# EAGLE schematic Spring12_6_Node (EAGLE 6.1)
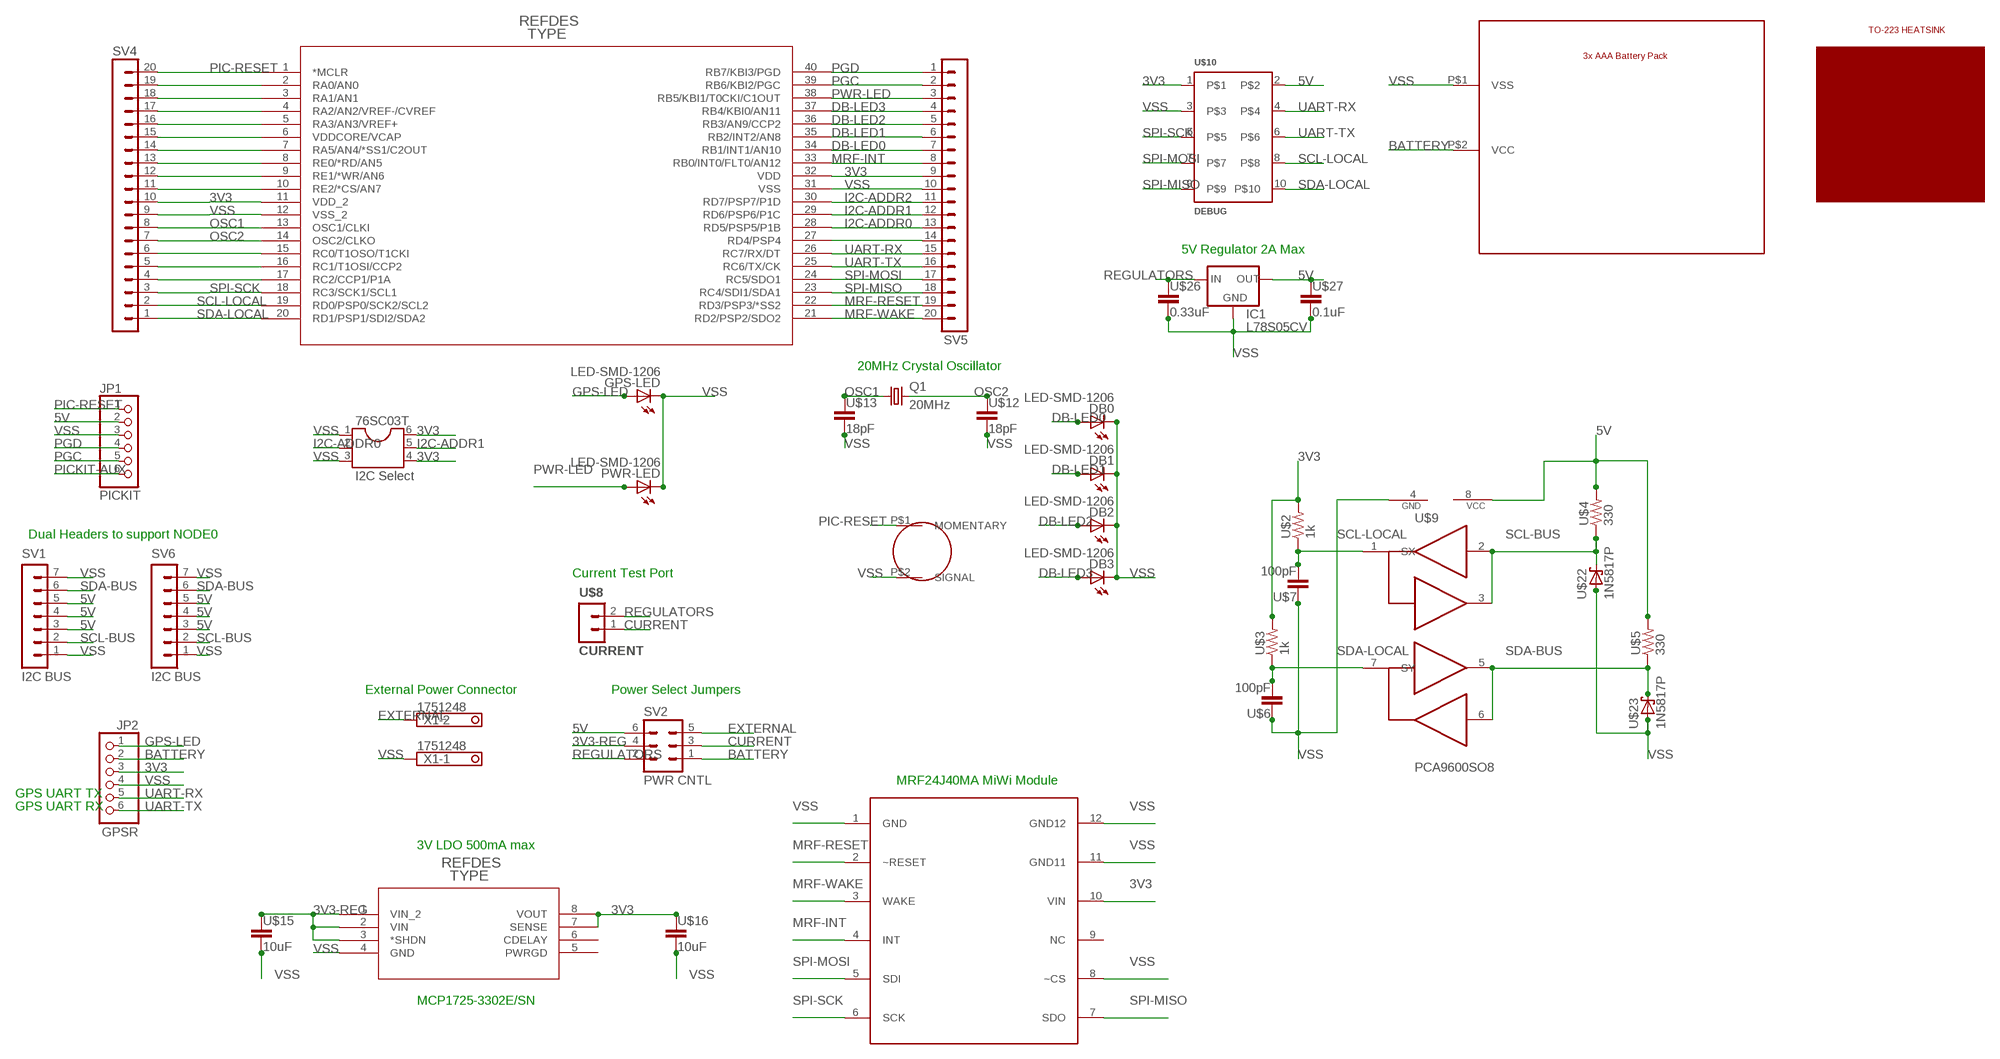
[diagram p0: schematic, sheet 1]

## Parts
76SC03T  I2C Select  DIL6  [DIL06]
DB0  LED-SMD-1206  [LED1206]
DB1  LED-SMD-1206  [LED1206]
DB2  LED-SMD-1206  [LED1206]
DB3  LED-SMD-1206  [LED1206]
GPS-LED  LED-SMD-1206  [LED1206]
IC1  L78S05CV  78XXL  [78XXL]
JP1  PICKIT  PINHD-1X6/90  [1X06/90]
JP2  GPSR  PINHD-1X6/90  [1X06/90]
PWR-LED  LED-SMD-1206  [LED1206]
Q1  20MHz  CRYSTALHC49U-V  [HC49U-V]
SV1  I2C BUS  MA07-1  [MA07-1]
SV2  PWR CNTL  MA03-2  [MA03-2]
SV4  MA20-1  [MA20-1]
SV5  MA20-1  [MA20-1]
SV6  I2C BUS  MA07-1  [MA07-1]
U$1  PIC18F45J10-X/P  [PDIP40_600MC]
U$2  1k  R-1/4W  [R-1/4W]
U$3  1k  R-1/4W  [R-1/4W]
U$4  330  R-1/4W  [R-1/4W]
U$5  330  R-1/4W  [R-1/4W]
U$6  100pF  C2.5-5  [C2.5-5]
U$7  100pF  C2.5-5  [C2.5-5]
U$8  CURRENT  MA02-1  [MA02-1]
U$9  PCA9600SO8  [SO08]
U$10  DEBUG  2510-6002  [2510-6002]
U$11  MRF24J40MA  [PCB12]
U$12  18pF  C2.5-5  [C2.5-5]
U$13  18pF  C2.5-5  [C2.5-5]
U$14  MCP1725-XXXXX/SN  [SOIC8-N_MC]
U$15  10uF  C2.5-5  [C2.5-5]
U$16  10uF  C2.5-5  [C2.5-5]
U$17  2479-BATTERY  [2479-BATTERY]
U$22  1N5817P  [1N5817]
U$23  1N5817P  [1N5817]
U$25  EVQ-11U05R  [EVQ-11U05R]
U$26  0.33uF  C2.5-5  [C2.5-5]
U$27  0.1uF  C2.5-5  [C2.5-5]
U$28  7-361-BA  [7-361-BA]
X1  1751248  [1751248]

## Nets
3V3: 76SC03T.4 76SC03T.6 JP2.3 SV4.10 SV5.9 U$1.11(VDD_2) U$1.32(VDD) U$2.2 U$3.2 U$10.1 U$11.10(VIN) U$14.7(SENSE) U$14.8(VOUT) U$16.1
3V3-REG: SV2.4 U$14.1(VIN_2) U$14.2(VIN) U$14.3(*SHDN) U$15.1
5V: IC1.OUT JP1.2 SV1.3 SV1.4 SV1.5 SV2.6 SV6.3 SV6.4 SV6.5 U$4.2 U$5.2 U$9.8(VCC) U$10.2 U$27.1
BATTERY: JP2.2 SV2.1 U$17.P$2(VCC)
CURRENT: SV2.3 U$8.1
DB-LED0: DB0.A SV5.7 U$1.34(RB1/INT1/AN10)
DB-LED1: DB1.A SV5.6 U$1.35(RB2/INT2/AN8)
DB-LED2: DB2.A SV5.5 U$1.36(RB3/AN9/CCP2)
DB-LED3: DB3.A SV5.4 U$1.37(RB4/KBI0/AN11)
EXTERNAL: SV2.5 X1.2
GPS-LED: GPS-LED.A JP2.1
I2C-ADDR0: 76SC03T.2 SV5.13 U$1.28(RD5/PSP5/P1B)
I2C-ADDR1: 76SC03T.5 SV5.12 U$1.29(RD6/PSP6/P1C)
I2C-ADDR2: SV5.11 U$1.30(RD7/PSP7/P1D)
MRF-INT: SV5.8 U$1.33(RB0/INT0/FLT0/AN12) U$11.4(INT)
MRF-RESET: SV5.19 U$1.22(RD3/PSP3/*SS2) U$11.2(~RESET)
MRF-WAKE: SV5.20 U$1.21(RD2/PSP2/SDO2) U$11.3(WAKE)
N$1: SV4.13 U$1.8(RE0/*RD/AN5)
N$2: SV4.6 U$1.15(RC0/T1OSO/T1CKI)
N$3: SV4.5 U$1.16(RC1/T1OSI/CCP2)
N$8: SV5.14 U$1.27(RD4/PSP4)
N$13: SV4.19 U$1.2(RA0/AN0)
N$14: SV4.18 U$1.3(RA1/AN1)
N$15: SV4.17 U$1.4(RA2/AN2/VREF-/CVREF)
N$16: SV4.16 U$1.5(RA3/AN3/VREF+)
N$17: SV4.15 U$1.6(VDDCORE/VCAP)
N$18: SV4.14 U$1.7(RA5/AN4/*SS1/C2OUT)
N$20: SV4.12 U$1.9(RE1/*WR/AN6)
N$21: SV4.11 U$1.10(RE2/*CS/AN7)
N$26: SV4.4
OSC1: Q1.1 SV4.8 U$1.13(OSC1/CLKI) U$13.1
OSC2: Q1.2 SV4.7 U$1.14(OSC2/CLKO) U$12.1
PGC: JP1.5 SV5.2 U$1.39(RB6/KBI2/PGC)
PGD: JP1.4 SV5.1 U$1.40(RB7/KBI3/PGD)
PIC-RESET: JP1.1 SV4.20 U$1.1(*MCLR) U$25.P$1(MOMENTARY)
PICKIT-AUX: JP1.6
PWR-LED: PWR-LED.A SV5.3 U$1.38(RB5/KBI1/T0CKI/C1OUT)
REGULATORS: IC1.IN SV2.2 U$8.2 U$26.1
SCL-BUS: SV1.2 SV6.2 U$4.1 U$9.2(RX) U$9.3(TX) U$22.C
SCL-LOCAL: SV4.2 U$2.1 U$7.2 U$9.1(SX) U$10.8
SDA-BUS: SV1.6 SV6.6 U$5.1 U$9.5(TY) U$9.6(RY) U$23.C
SDA-LOCAL: SV4.1 U$1.20(RD1/PSP1/SDI2/SDA2) U$3.1 U$6.2 U$9.7(SY) U$10.10
SPI-MISO: SV5.18 U$1.23(RC4/SDI1/SDA1) U$10.9 U$11.7(SDO)
SPI-MOSI: SV5.17 U$1.24(RC5/SDO1) U$10.7 U$11.5(SDI)
SPI-SCK: SV4.3 U$1.18(RC3/SCK1/SCL1) U$10.5 U$11.6(SCK)
UART-RX: JP2.5 SV5.15 U$1.26(RC7/RX/DT) U$10.4
UART-TX: JP2.6 SV5.16 U$1.25(RC6/TX/CK) U$10.6
VSS: 76SC03T.1 76SC03T.3 DB0.C DB1.C DB2.C DB3.C GPS-LED.C IC1.GND JP1.3 JP2.4 PWR-LED.C SV1.1 SV1.7 SV4.9 SV5.10 SV6.1 SV6.7 U$1.12(VSS_2) U$1.31(VSS) U$6.1 U$7.1 U$9.4(GND) U$10.3 U$11.1(GND) U$11.8(~CS) U$11.11(GND11) U$11.12(GND12) U$12.2 U$13.2 U$14.4(GND) U$15.2 U$16.2 U$17.P$1(VSS) U$22.A U$23.A U$25.P$2(SIGNAL) U$26.2 U$27.2 X1.1
Unconnected: U$1.17(RC2/CCP1/P1A) U$1.19(RD0/PSP0/SCK2/SCL2) U$11.9(NC) U$14.5(PWRGD) U$14.6(CDELAY)

## Notes on the sheet
- 5V Regulator 2A Max
- 20MHz Crystal Oscillator
- Dual Headers to support NODE0
- Current Test Port
- External Power Connector | Power Select Jumpers
- MRF24J40MA MiWi Module
- GPS UART TX
- GPS UART RX
- 3V LDO 500mA max
- MCP1725-3302E/SN

## Library data of the parts
76SC03T = ic-package:DIL6: Dual In Line / Socket
DB0 DB1-DB3 GPS-LED PWR-LED = 4534_I2C2:LED-SMD-1206: 160-1169-1-ND
IC1 = v-reg:78XXL: VOLTAGE REGULATOR
JP1 JP2 = pinhead:PINHD-1X6: PIN HEADER
Q1 = crystal:CRYSTAL: CRYSTAL; DIGIKEY: XC1723-ND; OC_FARNELL: 1666969; OC_NEWARK: unknown
SV1 SV6 = 4534_I2C2:MA07-1: Male Header 0.040 drill
SV2 = con-lstb:MA03-2: PIN HEADER; OC_FARNELL: unknown; OC_NEWARK: unknown
SV4 SV5 = con-lstb:MA20-1: PIN HEADER; OC_FARNELL: unknown; OC_NEWARK: unknown
U$1 = 4534_Node_Board:PIC18F45J10-X/P
U$2-U$5 = 4534_I2C2:R-1/4W: STANDARD 1/4W 5% RESISTOR
U$6 U$7 U$12 U$15 U$16 U$26 U$27 = 4534_I2C2:C2.5-5: CAPACITOR, 2.5 MM SPACING
U$8 = 4534_I2C2:MA02-1: Male Header 0.040 drill
U$9 = 4534_I2C2:PCA9600: I2C ACTIVE TERMINATOR SO-8
U$10 = 4534_I2C2:2510-6002: 3M 2510-6002 Walled Header
U$11 = 4534_Node_Board:MRF24J40MA
U$13 = 4534_I2C2:C2.5-5: CAPACITOR, 2.5 MM SPACING; DIGIKEY: 490-3632-ND
U$14 = 4534_Node_Board:MCP1725-XXXXX/SN; NEWARK: MCP1725-3002E/SN
U$17 = 4534_Node_Board:2479-BATTERY
U$22 U$23 = 4534_I2C2:1N5817: Schottky diode
U$25 = 4534_Node_Board:EVQ-11U05R
U$28 = 4534_Node_Board:7-361-BA
X1 = con-phoenix-350:1751248: MKDS 1/ 2-3,5 Printklemme Nennstrom: 10 A Bemessungsspannung: 160 V Raster: 3,5 mm Polzahl: 2 Montageart: Löten Anschlussart: Schraubanschluss Anschlussrichtung vom Leiter zur Platine: 0° Source: http://eshop.phoenixcontact.com .. 1751248.pdf; OC_FARNELL: unknown; OC_NEWARK: unknown